# Altium schematic sheet 04_Input_Output.SchDoc
size A; SheetNumber: 2; SheetTotal: 3
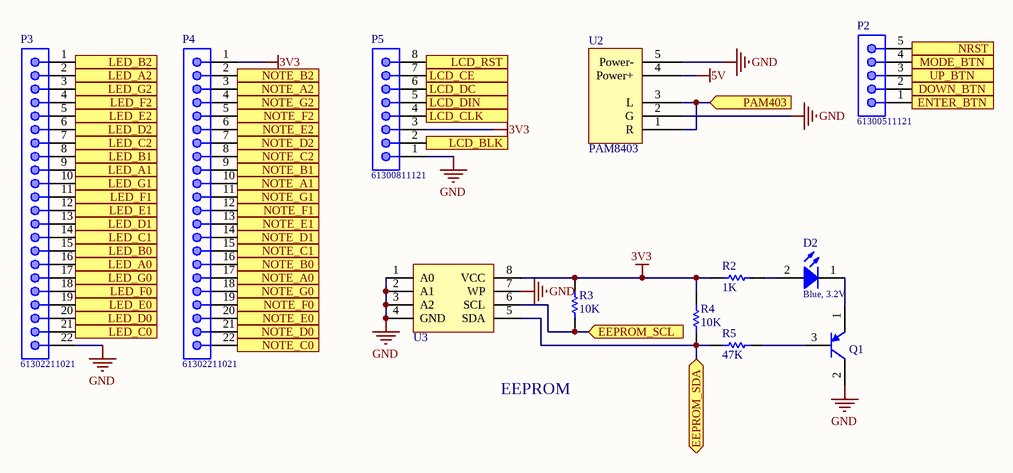
[diagram p0: 04_Input_Output.SchDoc]

## Parts
D2  Blue, 3.2V  [WL-SMCW_0603 dome]
P2  61300511121  [61300511121]
P3  61302211021  [61302211021]
P4  61302211021  [61302211021]
P5  61300811121  [61300811121]
Q1  A1015  [SOT23B]  (value not drawn)
R2  value 1K  [RES-SM-0603]  (hidden comment: RESISTOR SMD)
R3  value 10K  [RES-SM-0603]  (hidden comment: RESISTOR SMD)
R4  value 10K  [RES-SM-0603]  (hidden comment: RESISTOR SMD)
R5  value 47K  [RES-SM-0603]  (hidden comment: RESISTOR SMD)
U2  PAM8403  [PAM8403]
U3  24C256  [SOIC-8]  (value not drawn)

## Ports
DOWN_BTN (out), EEPROM_SCL (in), EEPROM_SDA (bidir), ENTER_BTN (out), LCD_BLK (in), LCD_CE (in), LCD_CLK (in), LCD_DC (in), LCD_DIN (out), LCD_RST (in), LED_A0 (in), LED_A1 (in), LED_A2 (in), LED_B0 (in), LED_B1 (in), LED_B2 (in), LED_C0 (in), LED_C1 (in), LED_C2 (in), LED_D0 (in), LED_D1 (in), LED_D2 (in), LED_E0 (in), LED_E1 (in), LED_E2 (in), LED_F0 (in), LED_F1 (in), LED_F2 (in), LED_G0 (in), LED_G1 (in), LED_G2 (in), MODE_BTN (out), NOTE_A0 (out), NOTE_A1 (out), NOTE_A2 (out), NOTE_B0 (out), NOTE_B1 (out), NOTE_B2 (out), NOTE_C0 (out), NOTE_C1 (out), NOTE_C2 (out), NOTE_D0 (out), NOTE_D1 (out), NOTE_D2 (out), NOTE_E0 (out), NOTE_E1 (out), NOTE_E2 (out), NOTE_F0 (out), NOTE_F1 (out), NOTE_F2 (out), NOTE_G0 (out), NOTE_G1 (out), NOTE_G2 (out), NRST (out), PAM403 (in), UP_BTN (out)

## Nets
3V3: P4.1 P5.3 R2.2 R3.2 R4.2 U3.8(VCC)
5V: U2.4(Power+)
GND: P3.22 P5.1 Q1.2(C) U2.2(G) U2.5(Power-) U3.1(A0) U3.2(A1) U3.3(A2) U3.4(GND) U3.7(WP)
DOWN_BTN: P2.2 ; port DOWN_BTN
EEPROM_SCL: R3.1 U3.6(SCL) ; port EEPROM_SCL
EEPROM_SDA: R4.1 R5.2 U3.5(SDA) ; port EEPROM_SDA
ENTER_BTN: P2.1 ; port ENTER_BTN
LCD_BLK: P5.2 ; port LCD_BLK
LCD_CE: P5.7 ; port LCD_CE
LCD_CLK: P5.4 ; port LCD_CLK
LCD_DC: P5.6 ; port LCD_DC
LCD_DIN: P5.5 ; port LCD_DIN
LCD_RST: P5.8 ; port LCD_RST
LED_A0: P3.16 ; port LED_A0
LED_A1: P3.9 ; port LED_A1
LED_A2: P3.2 ; port LED_A2
LED_B0: P3.15 ; port LED_B0
LED_B1: P3.8 ; port LED_B1
LED_B2: P3.1 ; port LED_B2
LED_C0: P3.21 ; port LED_C0
LED_C1: P3.14 ; port LED_C1
LED_C2: P3.7 ; port LED_C2
LED_D0: P3.20 ; port LED_D0
LED_D1: P3.13 ; port LED_D1
LED_D2: P3.6 ; port LED_D2
LED_E0: P3.19 ; port LED_E0
LED_E1: P3.12 ; port LED_E1
LED_E2: P3.5 ; port LED_E2
LED_F0: P3.18 ; port LED_F0
LED_F1: P3.11 ; port LED_F1
LED_F2: P3.4 ; port LED_F2
LED_G0: P3.17 ; port LED_G0
LED_G1: P3.10 ; port LED_G1
LED_G2: P3.3 ; port LED_G2
MODE_BTN: P2.4 ; port MODE_BTN
NOTE_A0: P4.17 ; port NOTE_A0
NOTE_A1: P4.10 ; port NOTE_A1
NOTE_A2: P4.3 ; port NOTE_A2
NOTE_B0: P4.16 ; port NOTE_B0
NOTE_B1: P4.9 ; port NOTE_B1
NOTE_B2: P4.2 ; port NOTE_B2
NOTE_C0: P4.22 ; port NOTE_C0
NOTE_C1: P4.15 ; port NOTE_C1
NOTE_C2: P4.8 ; port NOTE_C2
NOTE_D0: P4.21 ; port NOTE_D0
NOTE_D1: P4.14 ; port NOTE_D1
NOTE_D2: P4.7 ; port NOTE_D2
NOTE_E0: P4.20 ; port NOTE_E0
NOTE_E1: P4.13 ; port NOTE_E1
NOTE_E2: P4.6 ; port NOTE_E2
NOTE_F0: P4.19 ; port NOTE_F0
NOTE_F1: P4.12 ; port NOTE_F1
NOTE_F2: P4.5 ; port NOTE_F2
NOTE_G0: P4.18 ; port NOTE_G0
NOTE_G1: P4.11 ; port NOTE_G1
NOTE_G2: P4.4 ; port NOTE_G2
NRST: P2.5 ; port NRST
PAM403: U2.1(R) U2.3(L) ; port PAM403
UP_BTN: P2.3 ; port UP_BTN
NetD2_1: D2.1(K) Q1.1(E)
NetD2_2: D2.2(A) R2.1
NetQ1_3: Q1.3(B) R5.1

## Notes on the sheet
- EEPROM

## Library data of the parts
D2 = 150060BS84000: WL-SMCW SMT Mono-color Chip LED Waterclear, size 0603 dome, Blue, 3.2V, 40deg; Chip Technology: InGaN; Dominant Wavelength typ.: 470nm; Luminous Intensity typ.: 560mcd; Peak Wavelength typ.: 465nm; Viewing Angle: 40deg; ComponentLink1Description: Manufacturer; ComponentLink1URL: http://www.we-online.de; ComponentLink2URL: https://www.we-online.com/catalog/datasheet/150060BS84000.pdf; ComponentLink2Description: Datasheet; Forward Voltage typ.: 3.2V; Emitting Color: Blue; Mounting Technology: SMT; Operating Temperature: -40 to +85degC; Published Date: December 2019; Part Number: 150060BS84000; Packaging: Tape and Reel; Size: 0603 dome; Publisher: Wurth Elektronik
P2 = 61300511121: WR-PHD Pin Header, THT, pitch 2.54mm, Single Row, Vertical, 5p; Manufacturer: Wurth Elektronik; Pin Number: 5; Rated Current: 3A; Working Voltage: 250VAC; Withstanding Voltage: 500VAC; Contact Resistance: 20mOhm; ComponentLink1Description: Manufacturer; ComponentLink1URL: http://www.we-online.de; ComponentLink2Description: Datasheet; ComponentLink2URL: https://www.we-online.com/catalog/datasheet/61300511121.pdf; Manufacturer Part Number: 61300511121; Published Date: May 2020; Pitch: 2.54mm; Operating Temperature: -40 to +105degC; Mounting Technology: THT; Packaging: Bag; Gender: Pin Header; Row Number: Single; Orientation: Vertical
P3 P4 = 61302211021: WR-PHD Pin Header, THT, pitch 2.54mm, Single Row, Angled, 22p; Manufacturer: Wurth Elektronik; Pin Number: 22; Rated Current: 3A; Working Voltage: 250VAC; Withstanding Voltage: 500VAC; Contact Resistance: 20mOhm; ComponentLink1Description: Manufacturer; ComponentLink1URL: http://www.we-online.de; ComponentLink2Description: Datasheet; ComponentLink2URL: https://www.we-online.com/catalog/datasheet/61302211021.pdf; Manufacturer Part Number: 61302211021; Published Date: May 2020; Pitch: 2.54mm; Operating Temperature: -40 to +105degC; Mounting Technology: THT; Packaging: Bag; Gender: Pin Header; Row Number: Single; Orientation: Angled
P5 = 61300811121: WR-PHD Pin Header, THT, pitch 2.54mm, Single Row, Vertical, 8p; Manufacturer: Wurth Elektronik; Pin Number: 8; Rated Current: 3A; Working Voltage: 250VAC; Withstanding Voltage: 500VAC; Contact Resistance: 20mOhm; ComponentLink1Description: Manufacturer; ComponentLink1URL: http://www.we-online.de; ComponentLink2Description: Datasheet; ComponentLink2URL: https://www.we-online.com/catalog/datasheet/61300811121.pdf; Manufacturer Part Number: 61300811121; Published Date: May 2020; Pitch: 2.54mm; Operating Temperature: -40 to +105degC; Mounting Technology: THT; Packaging: Bag; Gender: Pin Header; Row Number: Single; Orientation: Vertical
Q1 = A1015: PNP Bipolar Transistor
R2-R5 = RESISTOR SMD: Resistor
U3 = 24C256: EEPROM Memory IC 256Kb (32K x 8) I²C 1 MHz 550 ns 8-SOIC; Mfr: Microchip Technology; Memory Type: Non-Volatile; Clock Frequency: 1 MHz; Write Cycle Time - Word, Page: 5ms; Access Time: 550 ns; Voltage - Supply: 1.7V ~ 5.5V; Base Product Number: AT24C256C; Category: Integrated Circuits (ICs); Memory Format: EEPROM; Technology: EEPROM; Memory Size: 256Kb (32K x 8); Memory Interface: I²C; Operating Temperature: -40°C ~ 85°C (TA); Mounting Type: Surface Mount; Package / Case: 8-SOIC (0.154", 3.90mm Width); Supplier Device Package: 8-SOIC; ComponentLink1Description: Digikey; ComponentLink1URL: https://www.digikey.com/en/products/detail/microchip-technology/AT24C256C-SSHL-T/2271166